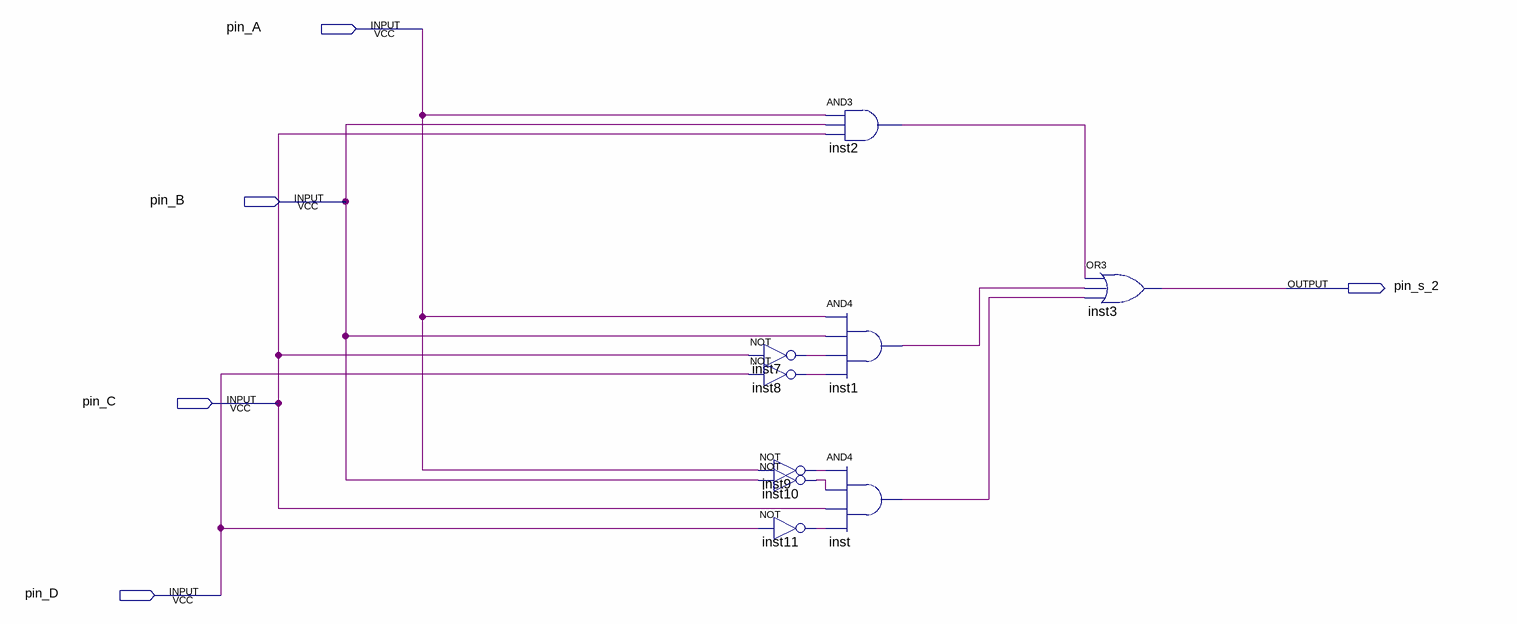
[diagram p0: schematic sheet]
// Quartus schematic s_2 - Copy.bdf as structural Verilog: 9 symbols, 5 pins
module \s_2_-_Copy  (
  input  pin_A,
  input  pin_B,
  input  pin_C,
  input  pin_D,
  output pin_s_2
);

  wire inst1_out, inst2_out, inst7_out, inst8_out, inst9_out, inst10_out, inst11_out, inst_out;

  not inst7 (inst7_out, pin_C);
  not inst8 (inst8_out, pin_D);
  not inst9 (inst9_out, pin_A);
  not inst10 (inst10_out, pin_B);
  not inst11 (inst11_out, pin_D);
  and inst2 (inst2_out, pin_A, pin_B, pin_C);
  and inst1 (inst1_out, pin_A, pin_B, inst7_out, inst8_out);
  and inst (inst_out, inst9_out, inst10_out, pin_C, inst11_out);
  or inst3 (pin_s_2, inst2_out, inst1_out, inst_out);
endmodule
